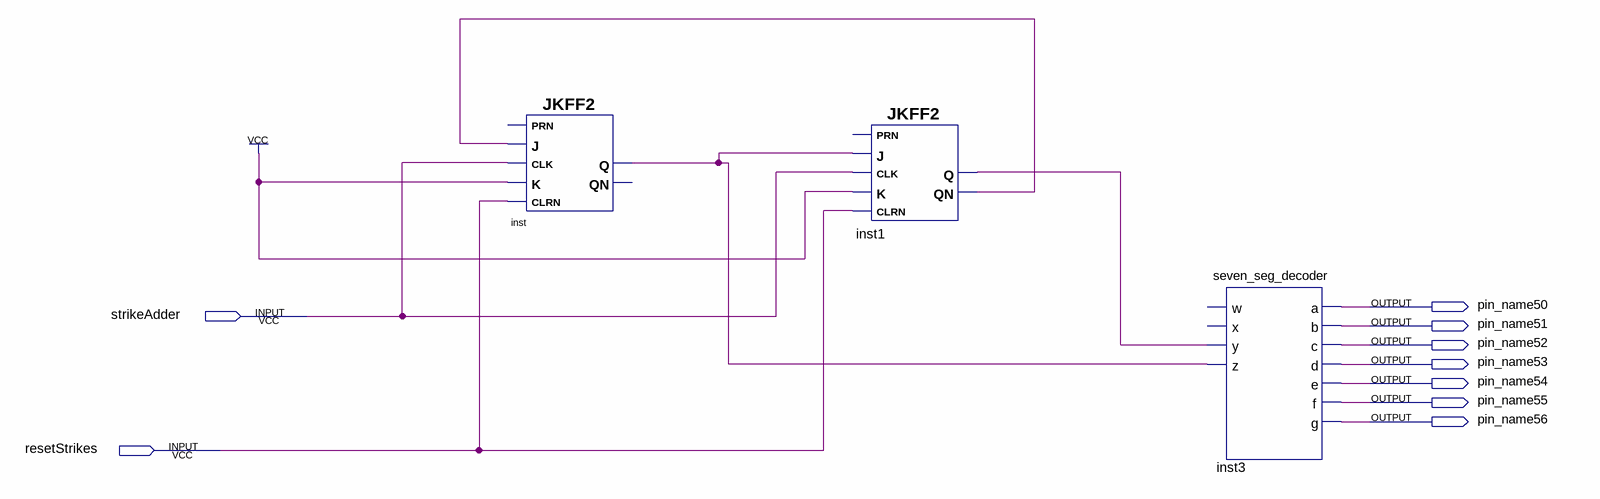
[diagram p0: schematic sheet]
// Quartus schematic strikeCounter.bdf as structural Verilog: 3 symbols, 9 pins
module strikeCounter (
  input  strikeAdder,
  input  resetStrikes,
  output pin_name50,
  output pin_name51,
  output pin_name52,
  output pin_name53,
  output pin_name54,
  output pin_name55,
  output pin_name56
);

  wire inst1_q, inst1_qn, inst_q;

  JKFF2 inst (.K(1'b1), .CLRN(resetStrikes), .CLK(strikeAdder), .J(inst1_qn), .Q(inst_q));  // open: PRN, QN
  JKFF2 inst1 (.K(1'b1), .CLRN(resetStrikes), .CLK(strikeAdder), .J(inst_q), .QN(inst1_qn), .Q(inst1_q));  // open: PRN
  seven_seg_decoder inst3 (
    .y(inst1_q), .z(inst_q), .a(pin_name50), .b(pin_name51), .c(pin_name52), .d(pin_name53), .e(pin_name54),
    .f(pin_name55), .g(pin_name56));  // open: w, x
endmodule
